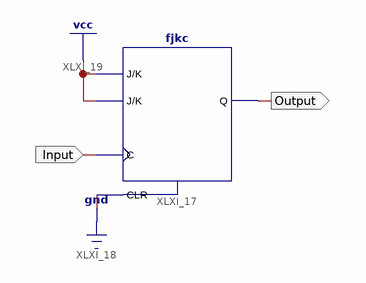
[diagram p0: schematic sheet 1]
// Xilinx ISE schematic Toggle.sch (spartan6) as structural Verilog: 1 symbols, 2 ports
module Toggle (
  input  Input,
  output Output
);

  fjkc XLXI_17 (.C(Input), .CLR(1'b0), .J(1'b1), .K(1'b1), .Q(Output));
endmodule
